# EasyEDA schematic SCH_Macros-Keyboard_2024-05-12.json
TITLE: Sheet_1; REV: 1.0; Date: 2024-05-12; Sheet: 1/1; Drawn By: bsb21134; Company: Your Company
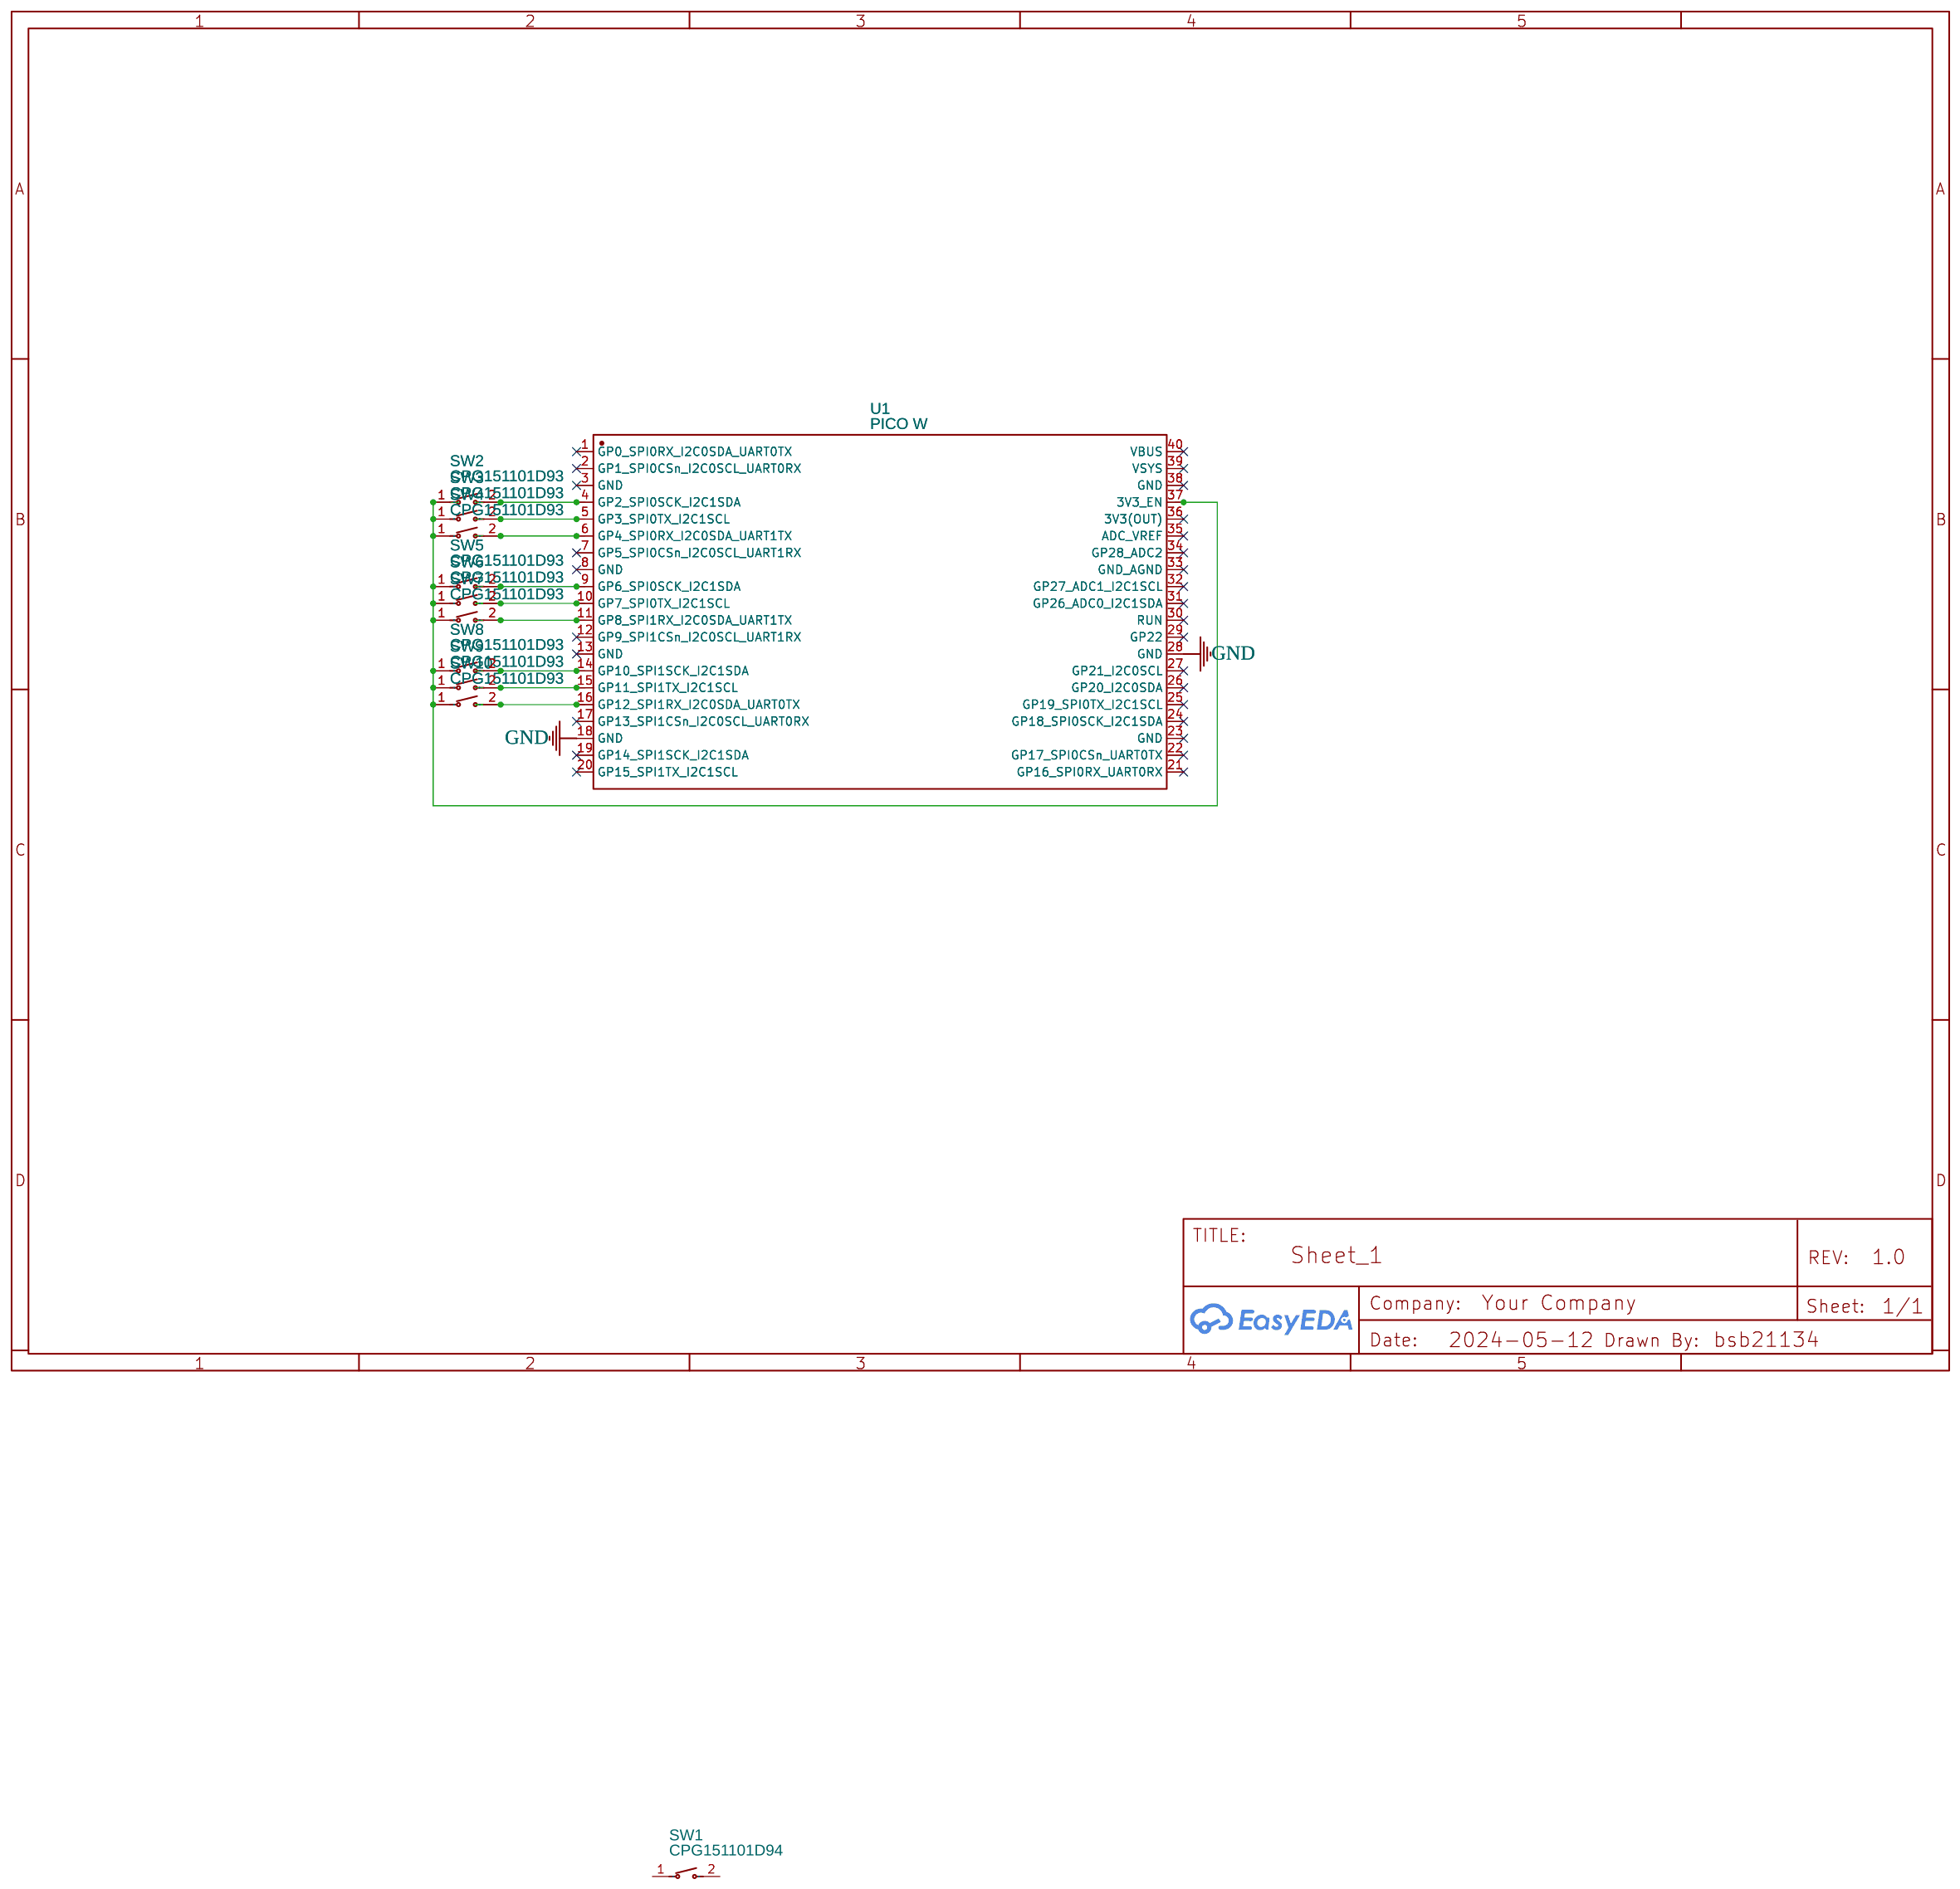
[diagram p0: schematic sheet]

## Parts
SW1  CPG151101D94  [SW-TH_CPG151101D9X]
SW2  CPG151101D93  [SW-TH_CPG151101D9X]
SW3  CPG151101D93  [SW-TH_CPG151101D9X]
SW4  CPG151101D93  [SW-TH_CPG151101D9X]
SW5  CPG151101D93  [SW-TH_CPG151101D9X]
SW6  CPG151101D93  [SW-TH_CPG151101D9X]
SW7  CPG151101D93  [SW-TH_CPG151101D9X]
SW8  CPG151101D93  [SW-TH_CPG151101D9X]
SW9  CPG151101D93  [SW-TH_CPG151101D9X]
SW10  CPG151101D93  [SW-TH_CPG151101D9X]
U1  PICO W  [LCC-40_L51.0-W21.0-P2.54-BL_RP2040-BASED]

## Library data of the parts
SW1 = CPG151101D94: Contributor: LCSC; Supplier: LCSC; Supplier Part: C400236; Manufacturer: Kailh(凯华); JLCPCB Part Class: Extended Part
SW2-SW10 = CPG151101D93: Contributor: LCSC; Supplier: LCSC; Supplier Part: C400237; Manufacturer: Kailh(凯华); JLCPCB Part Class: Extended Part
U1 = PICO W: Supplier: LCSC; Supplier Part: C7203003; Manufacturer: Raspberry Pi(树莓派); Contributor: lcsc; JLCPCB Part Class: Extended Part

## Nets
GND: U1.18(GND) U1.28(GND)
Net-(SW2-1): SW2.1 SW3.1 SW4.1 SW5.1 SW6.1 SW7.1 SW8.1 SW9.1 SW10.1 U1.37(3V3_EN)
Net-(SW2-2): SW2.2 U1.4(GP2_SPI0SCK_I2C1SDA)
Net-(SW3-2): SW3.2 U1.5(GP3_SPI0TX_I2C1SCL)
Net-(SW4-2): SW4.2 U1.6(GP4_SPI0RX_I2C0SDA_UART1TX)
Net-(SW5-2): SW5.2 U1.9(GP6_SPI0SCK_I2C1SDA)
Net-(SW6-2): SW6.2 U1.10(GP7_SPI0TX_I2C1SCL)
Net-(SW7-2): SW7.2 U1.11(GP8_SPI1RX_I2C0SDA_UART1TX)
Net-(SW8-2): SW8.2 U1.14(GP10_SPI1SCK_I2C1SDA)
Net-(SW9-2): SW9.2 U1.15(GP11_SPI1TX_I2C1SCL)
Net-(SW10-2): SW10.2 U1.16(GP12_SPI1RX_I2C0SDA_UART0TX)

Not connected (* = marked no-connect by the designer): SW1 1 2; U1 1(GP0_SPI0RX_I2C0SDA_UART0TX)* 2(GP1_SPI0CSn_I2C0SCL_UART0RX)* 3(GND)* 7(GP5_SPI0CSn_I2C0SCL_UART1RX)* 8(GND)* 12(GP9_SPI1CSn_I2C0SCL_UART1RX)* 13(GND)* 17(GP13_SPI1CSn_I2C0SCL_UART0RX)* 19(GP14_SPI1SCK_I2C1SDA)* 20(GP15_SPI1TX_I2C1SCL)* 21(GP16_SPI0RX_UART0RX)* 22(GP17_SPI0CSn_UART0TX)* 23(GND)* 24(GP18_SPI0SCK_I2C1SDA)* 25(GP19_SPI0TX_I2C1SCL)* 26(GP20_I2C0SDA)* 27(GP21_I2C0SCL)* 29(GP22)* 30(RUN)* 31(GP26_ADC0_I2C1SDA)* 32(GP27_ADC1_I2C1SCL)* 33(GND_AGND)* 34(GP28_ADC2)* 35(ADC_VREF)* 36(3V3(OUT))* 38(GND)* 39(VSYS)* 40(VBUS)*
